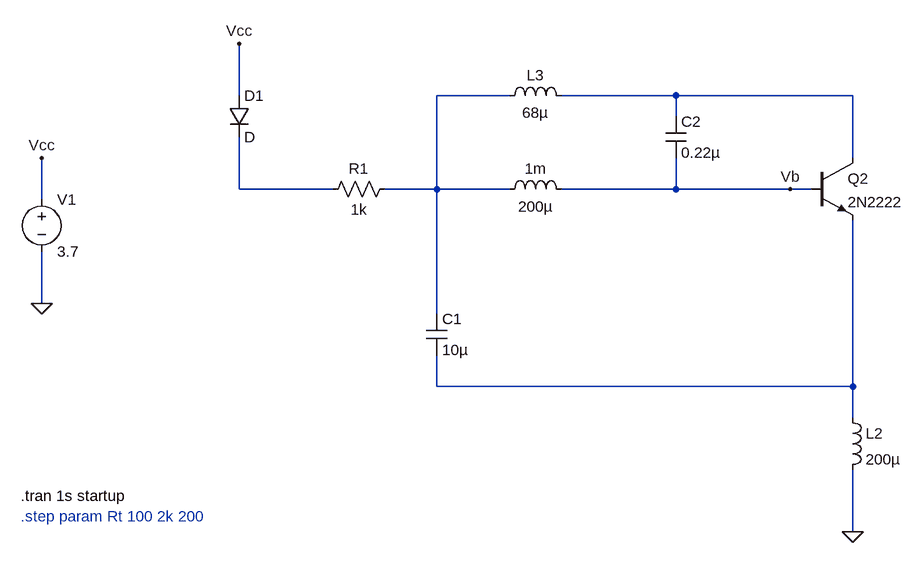
[diagram p0: schematic minati_fig-4a.asc]
minati_fig-4a.asc, the LTspice schematic file:
Version 4
SHEET 1 880 680
WIRE -528 -80 -528 -160
WIRE -112 -80 -224 -80
WIRE 144 -80 -32 -80
WIRE 416 -80 144 -80
WIRE 144 -48 144 -80
WIRE 416 16 416 -80
WIRE -528 64 -528 -16
WIRE -384 64 -528 64
WIRE -224 64 -224 -80
WIRE -224 64 -304 64
WIRE -112 64 -224 64
WIRE 144 64 144 16
WIRE 144 64 -32 64
WIRE 320 64 144 64
WIRE 352 64 320 64
WIRE -832 80 -832 16
WIRE -832 240 -832 160
WIRE -224 256 -224 64
WIRE -224 368 -224 320
WIRE 416 368 416 112
WIRE 416 368 -224 368
WIRE 416 416 416 368
WIRE 416 592 416 496
FLAG -832 16 Vcc
FLAG -832 240 0
FLAG 416 592 0
FLAG -528 -160 Vcc
FLAG 320 64 Vb
SYMBOL ind -128 80 R270
WINDOW 0 32 56 VTop 2
WINDOW 3 5 56 VBottom 2
SYMATTR InstName 1m
SYMATTR Value 200µ
SYMBOL ind 400 400 R0
SYMATTR InstName L2
SYMATTR Value 200µ
SYMBOL res -288 48 R90
WINDOW 0 0 56 VBottom 2
WINDOW 3 32 56 VTop 2
SYMATTR InstName R1
SYMATTR Value 1k
SYMBOL voltage -832 64 R0
WINDOW 123 0 0 Left 0
WINDOW 39 0 0 Left 0
SYMATTR InstName V1
SYMATTR Value 3.7
SYMBOL npn 352 16 R0
SYMATTR InstName Q2
SYMATTR Value 2N2222
SYMBOL cap -240 256 R0
SYMATTR InstName C1
SYMATTR Value 10µ
SYMBOL ind -128 -64 R270
WINDOW 0 32 56 VTop 2
WINDOW 3 5 56 VBottom 2
SYMATTR InstName L3
SYMATTR Value 68µ
SYMBOL diode -544 -80 R0
SYMATTR InstName D1
SYMBOL cap 128 -48 R0
SYMATTR InstName C2
SYMATTR Value 0.22µ
TEXT -864 536 Left 2 !.tran 1s startup
TEXT -864 568 Left 2 ;.step param Rt 100 2k 200

The netlist it stands for:
* minati_fig-4a.asc
L§1m N001 Vb 200µ
L2 N004 0 200µ
R1 N001 N003 1k
V1 Vcc 0 3.7
Q2 N002 Vb N004 0 2N2222
C1 N001 N004 10µ
L3 N001 N002 68µ
D1 Vcc N003 D
C2 N002 Vb 0.22µ
.model D D
.lib standard.dio
.model NPN NPN
.model PNP PNP
.lib standard.bjt
.tran 1s startup
* .step param Rt 100 2k 200
.backanno
.end